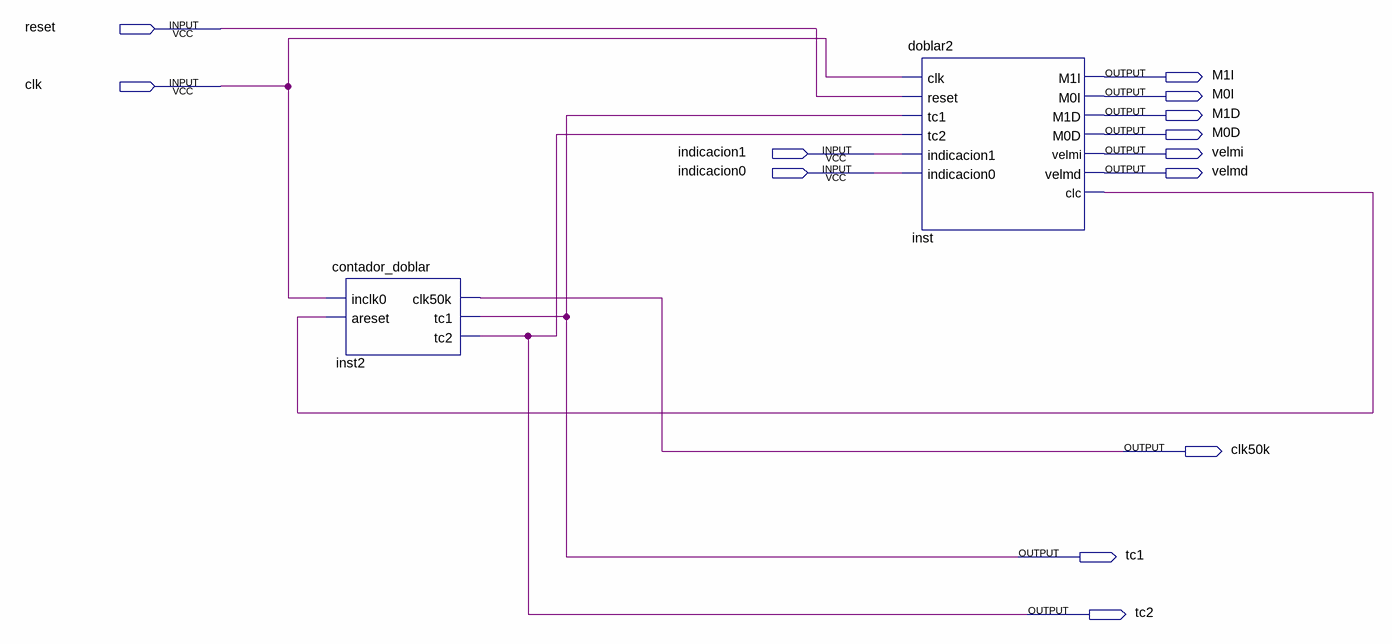
[diagram p0: schematic sheet]
// Quartus schematic prueba1.bdf as structural Verilog: 2 symbols, 13 pins
module prueba1 (
  input  reset,
  input  clk,
  input  indicacion1,
  input  indicacion0,
  output M1I,
  output M0I,
  output M1D,
  output M0D,
  output velmi,
  output velmd,
  output clk50k,
  output tc1,
  output tc2
);

  wire inst_clc;

  contador_doblar inst2 (.inclk0(clk), .areset(inst_clc), .clk50k(clk50k), .tc1(tc1), .tc2(tc2));
  doblar2 inst (
    .clk(clk), .reset(reset), .tc1(tc1), .tc2(tc2), .indicacion1(indicacion1), .indicacion0(indicacion0),
    .M1I(M1I), .M0I(M0I), .M1D(M1D), .M0D(M0D), .velmi(velmi), .velmd(velmd), .clc(inst_clc));
endmodule
